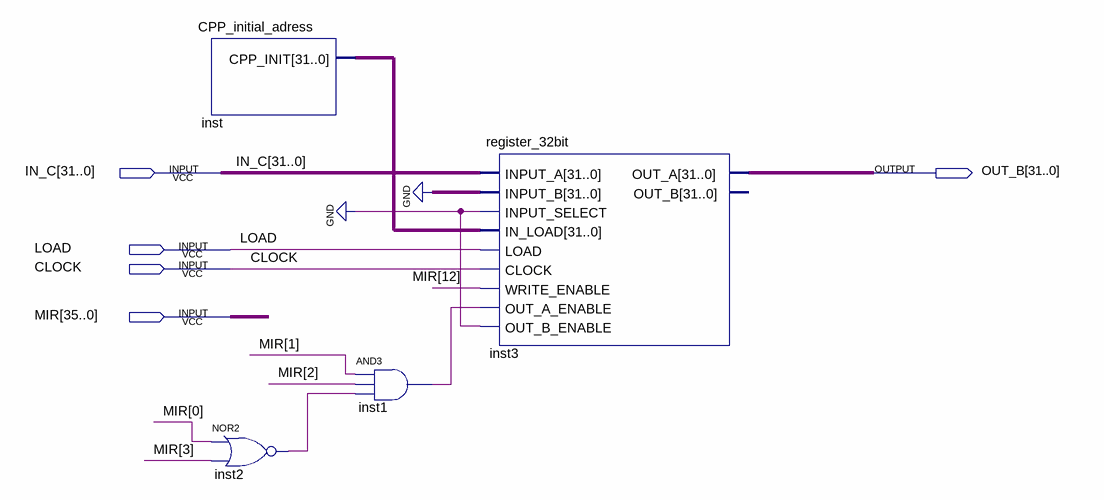
[diagram p0: schematic sheet]
// Quartus schematic CPP.bdf as structural Verilog: 4 symbols, 5 pins
module CPP (
  input  [31:0] IN_C,
  input  LOAD,
  input  CLOCK,
  input  [35:0] MIR,
  output [31:0] OUT_B
);

  wire inst1_out, inst2_out;
  wire [31:0] inst_cpp_init;

  CPP_initial_adress inst (.CPP_INIT(inst_cpp_init));
  nor inst2 (inst2_out, MIR[0], MIR[3]);
  and inst1 (inst1_out, MIR[1], MIR[2], inst2_out);
  register_32bit inst3 (
    .INPUT_A(IN_C), .INPUT_B({32{1'b0}}), .INPUT_SELECT(1'b0), .IN_LOAD(inst_cpp_init), .LOAD(LOAD),
    .CLOCK(CLOCK), .WRITE_ENABLE(MIR[12]), .OUT_A_ENABLE(inst1_out), .OUT_B_ENABLE(1'b0), .OUT_A(OUT_B));  // open: OUT_B
endmodule
